# EAGLE design DiveComputer_Flash (EAGLE 7.5.0)
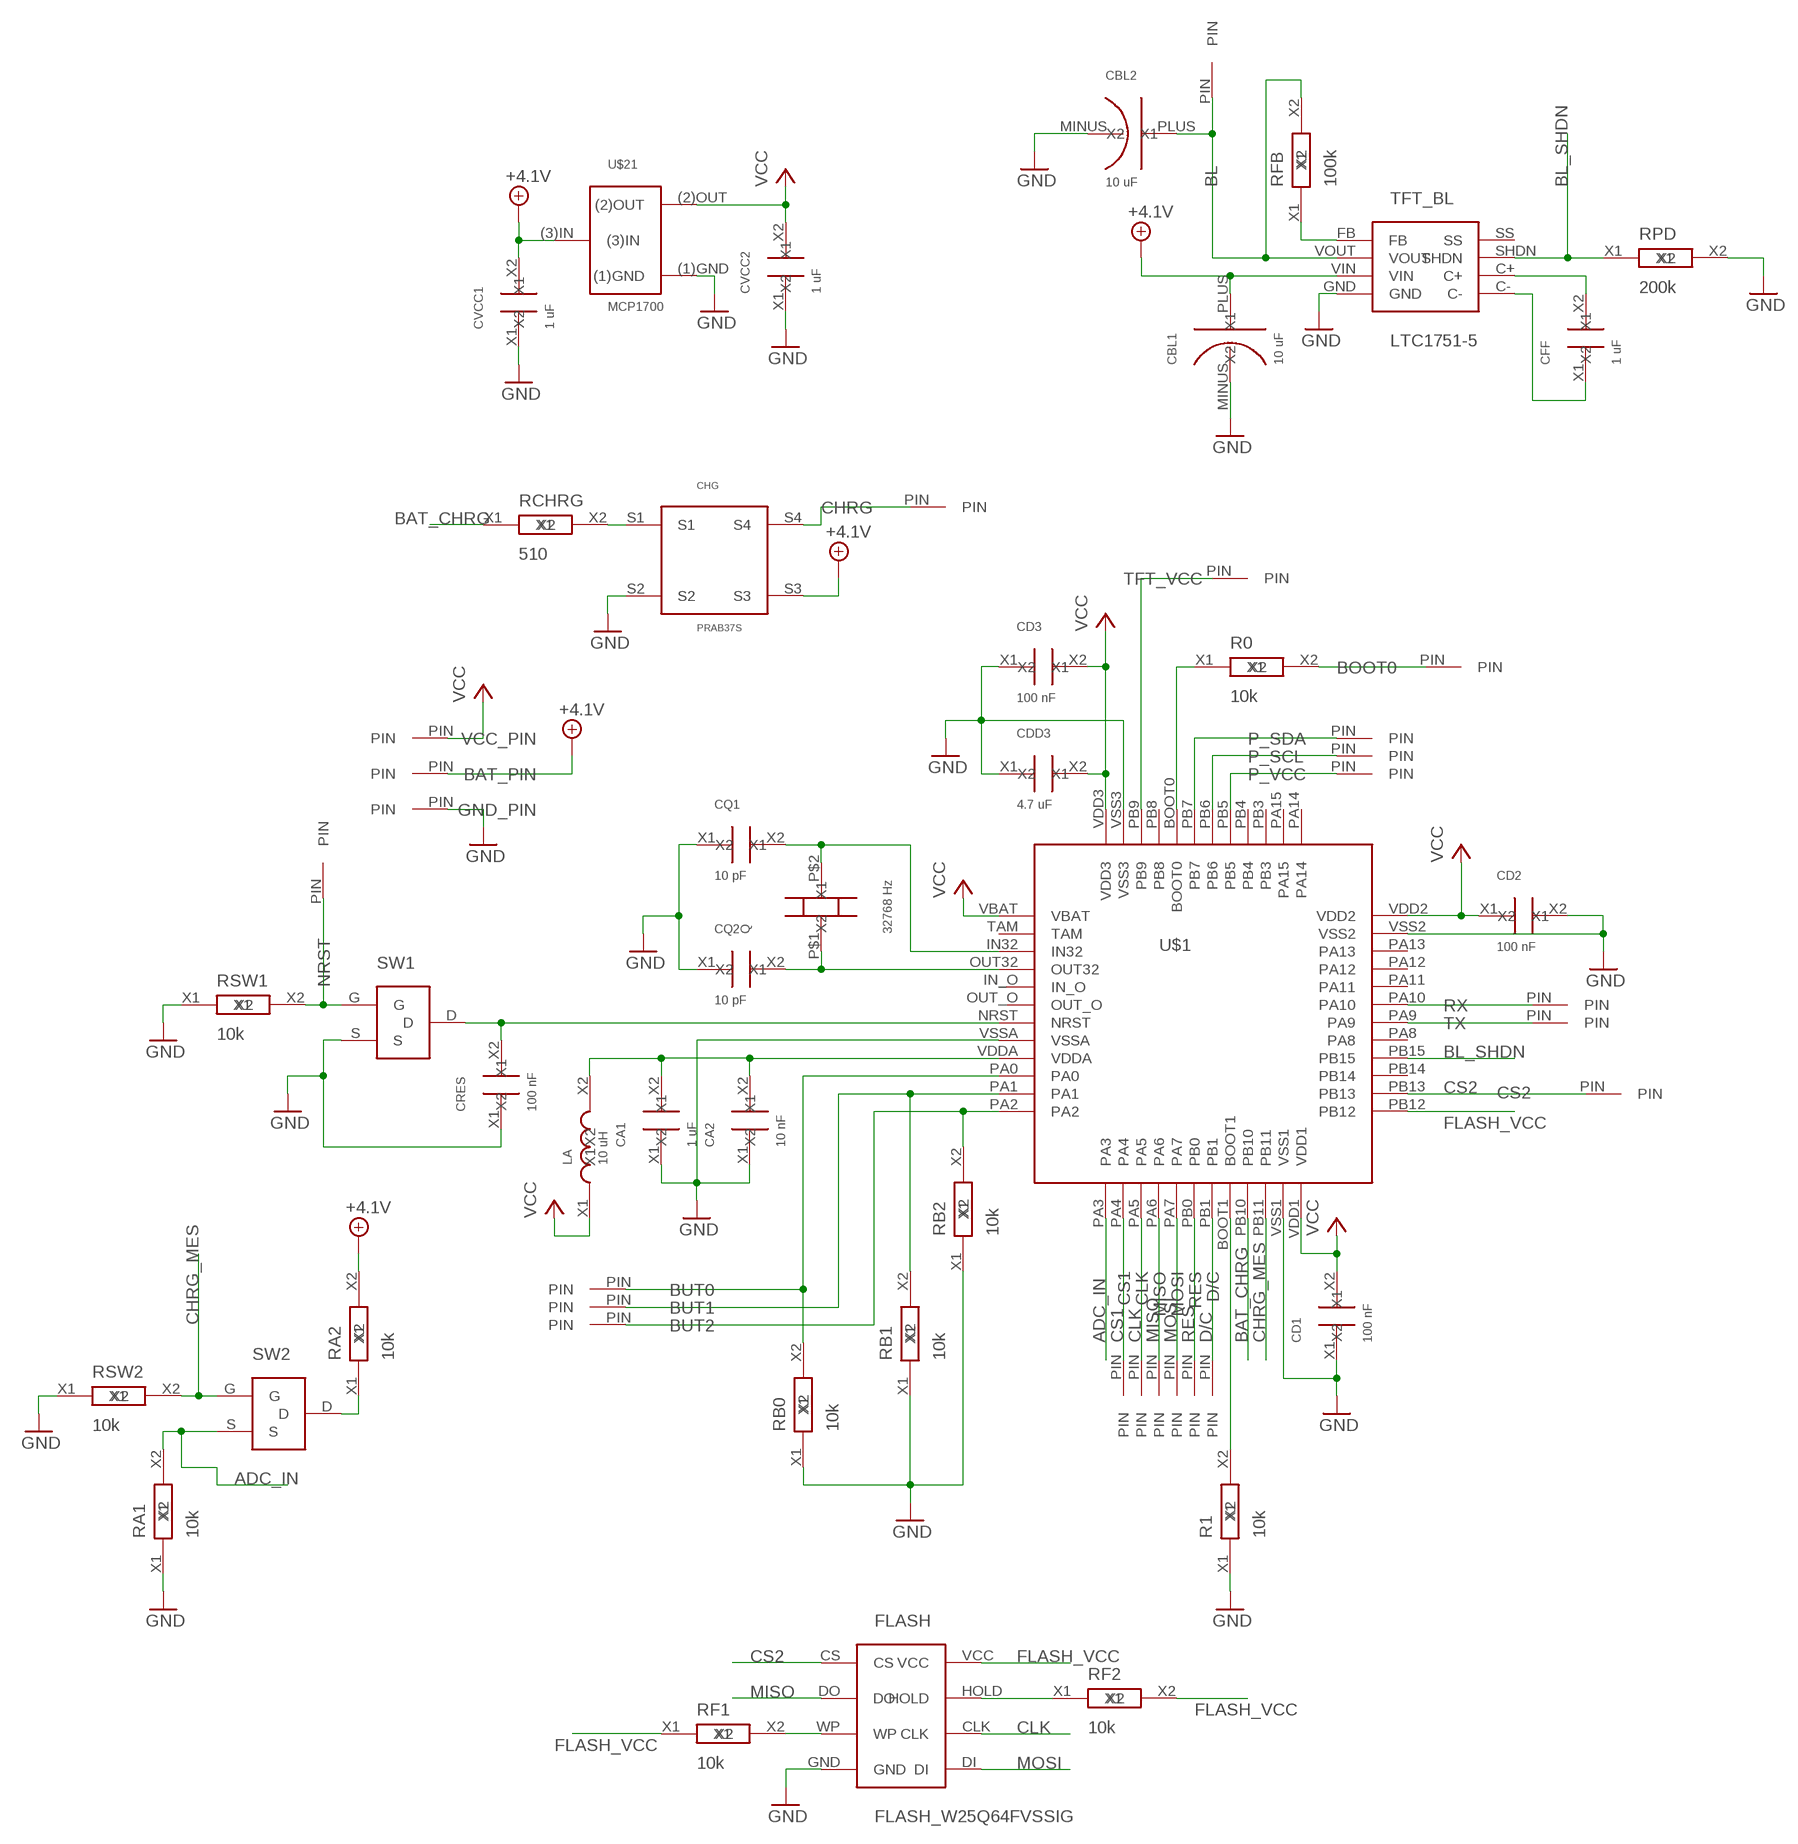
[diagram p0: schematic, sheet 1]

## Parts
BAT_PIN  PIN_06  [PIN_06]
BL  PIN_06  [PIN_06]
BOOT0  PIN_06  [PIN_06]
BUT0  PIN_06  [PIN_06]
BUT1  PIN_06  [PIN_06]
BUT2  PIN_06  [PIN_06]
CA1  1 uF  C_SMD_2.1X1.25  [SMD_2.1X1.25]
CA2  10 nF  C_SMD_2.1X1.25  [SMD_2.1X1.25]
CBL1  10 uF  C_SMD_TA_A  [C_SMD_TA_A]
CBL2  10 uF  C_SMD_TA_A  [C_SMD_TA_A]
CD1  100 nF  C_SMD_2.1X1.25  [SMD_2.1X1.25]
CD2  100 nF  C_SMD_2.1X1.25  [SMD_2.1X1.25]
CD3  100 nF  C_SMD_2.1X1.25  [SMD_2.1X1.25]
CDD3  4.7 uF  C_SMD_2.1X1.25  [SMD_2.1X1.25]
CFF  1 uF  C_SMD_2.1X1.25  [SMD_2.1X1.25]
CHG  PRAB37S  [PRAB37S]
CHRG  PIN_06  [PIN_06]
CLK  PIN_06  [PIN_06]
CQ1  10 pF  C_SMD_2.1X1.25  [SMD_2.1X1.25]
CQ2  10 pF  C_SMD_2.1X1.25  [SMD_2.1X1.25]
CRES  100 nF  C_SMD_2.1X1.25  [SMD_2.1X1.25]
CS1  PIN_06  [PIN_06]
CS2  PIN_06  [PIN_06]
CVCC1  1 uF  C_SMD_2.1X1.25  [SMD_2.1X1.25]
CVCC2  1 uF  C_SMD_2.1X1.25  [SMD_2.1X1.25]
D/C  PIN_06  [PIN_06]
FLASH  FLASH_W25Q64FVSSIG  [FLASH_W25Q64FVSSIG]
GND_PIN  PIN_06  [PIN_06]
LA  10 uH  L_SMD_2.1X1.25  [SMD_2.1X1.25]
MISO  PIN_06  [PIN_06]
MOSI  PIN_06  [PIN_06]
NRST  PIN_06  [PIN_06]
P_SCL  PIN_06  [PIN_06]
P_SDA  PIN_06  [PIN_06]
P_VCC  PIN_06  [PIN_06]
Q  32768 Hz  QUARTZ_CYL  [QUARTZ_CYL]
R0  10k  R_SMD_2.1X1.25  [SMD_2.1X1.25]
R1  10k  R_SMD_2.1X1.25  [SMD_2.1X1.25]
RA1  10k  R_SMD_2.1X1.25  [SMD_2.1X1.25]
RA2  10k  R_SMD_2.1X1.25  [SMD_2.1X1.25]
RB0  10k  R_SMD_2.1X1.25  [SMD_2.1X1.25]
RB1  10k  R_SMD_2.1X1.25  [SMD_2.1X1.25]
RB2  10k  R_SMD_2.1X1.25  [SMD_2.1X1.25]
RCHRG  510  R_SMD_2.1X1.25  [SMD_2.1X1.25]
RES  PIN_06  [PIN_06]
RF1  10k  R_SMD_2.1X1.25  [SMD_2.1X1.25]
RF2  10k  R_SMD_2.1X1.25  [SMD_2.1X1.25]
RFB  100k  R_SMD_2.1X1.25  [SMD_2.1X1.25]
RPD  200k  R_SMD_2.1X1.25  [SMD_2.1X1.25]
RSW1  10k  R_SMD_2.1X1.25  [SMD_2.1X1.25]
RSW2  10k  R_SMD_2.1X1.25  [SMD_2.1X1.25]
RX  PIN_06  [PIN_06]
SW1  IRFML8244TRPBF  [IRFML8244TRPBF]
SW2  IRFML8244TRPBF  [IRFML8244TRPBF]
TFT_BL  LTC1751-5  [LTC1751-5]
TFT_VCC  PIN_06  [PIN_06]
TX  PIN_06  [PIN_06]
U$1  STM32F103CBT6  [STM32F103CBT6]
U$21  MCP1700  [MCP1700]
VCC_PIN  PIN_06  [PIN_06]

## Nets
+4.1V: BAT_PIN.PIN CBL1.PLUS(X2) CHG.S3 CVCC1.X2 RA2.X2 TFT_BL.VIN U$21.(3)IN
ADC_IN: RA1.X2 SW2.S U$1.PA3
BAT_CHRG: RCHRG.X1 U$1.PB10
BL_SHDN: RPD.X1 TFT_BL.SHDN U$1.PB15
CHRG_MES: RSW2.X2 SW2.G U$1.PB11
CLK: CLK.PIN FLASH.CLK U$1.PA5
CS1: CS1.PIN U$1.PA4
CS2: CS2.PIN FLASH.CS U$1.PB13
D/C: D/C.PIN U$1.PB1
FLASH_VCC: FLASH.VCC RF1.X1 RF2.X2 U$1.PB12
GND: CA1.X1 CA2.X1 CBL1.MINUS(X1) CBL2.MINUS(X1) CD1.X1 CD2.X2 CD3.X1 CDD3.X1 CHG.S2 CQ1.X1 CQ2.X1 CRES.X1 CVCC1.X1 CVCC2.X1 FLASH.GND GND_PIN.PIN R1.X1 RA1.X1 RB0.X1 RB1.X1 RB2.X1 RPD.X2 RSW1.X1 RSW2.X1 SW1.S TFT_BL.GND U$1.VSS1 U$1.VSS2 U$1.VSS3 U$1.VSSA U$21.(1)GND
MISO: FLASH.DO MISO.PIN U$1.PA6
MOSI: FLASH.DI MOSI.PIN U$1.PA7
N$1: R0.X1 U$1.BOOT0
N$2: BOOT0.PIN R0.X2
N$3: P_VCC.PIN U$1.PB5
N$4: P_SCL.PIN U$1.PB6
N$5: P_SDA.PIN U$1.PB7
N$6: RX.PIN U$1.PA10
N$7: TX.PIN U$1.PA9
N$8: CQ1.X2 Q.P$2(X2) U$1.IN32
N$9: R1.X2 U$1.BOOT1
N$10: CQ2.X2 Q.P$1(X1) U$1.OUT32
N$11: CRES.X2 SW1.D U$1.NRST
N$12: NRST.PIN RSW1.X2 SW1.G
N$13: CA1.X2 CA2.X2 LA.X2 U$1.VDDA
N$14: BUT0.PIN RB0.X2 U$1.PA0
N$15: BUT1.PIN RB1.X2 U$1.PA1
N$16: BUT2.PIN RB2.X2 U$1.PA2
N$17: CHG.S4 CHRG.PIN
N$18: CHG.S1 RCHRG.X2
N$19: FLASH.WP RF1.X2
N$20: FLASH.HOLD RF2.X1
N$21: RA2.X1 SW2.D
N$22: CFF.X2 TFT_BL.C+
N$23: CFF.X1 TFT_BL.C-
N$24: RFB.X1 TFT_BL.FB
N$25: BL.PIN CBL2.PLUS(X2) RFB.X2 TFT_BL.VOUT
N$26: TFT_VCC.PIN U$1.PB9
RES: RES.PIN U$1.PB0
VCC: CD1.X2 CD2.X1 CD3.X2 CDD3.X2 CVCC2.X2 LA.X1 U$1.VBAT U$1.VDD1 U$1.VDD2 U$1.VDD3 U$21.(2)OUT VCC_PIN.PIN
Unconnected: TFT_BL.SS U$1.IN_O U$1.OUT_O U$1.PA8 U$1.PA11 U$1.PA12 U$1.PA13 U$1.PA14 U$1.PA15 U$1.PB3 U$1.PB4 U$1.PB8 U$1.PB14 U$1.TAM

## Library data of the parts
BAT_PIN BL BOOT0 BUT0 BUT1 BUT2 CHRG CLK CS1 CS2 D/C GND_PIN MISO MOSI NRST P_SCL P_SDA P_VCC RES RX TFT_VCC TX VCC_PIN = My_STM32:PIN_06
CA1 CA2 CD1-CD3 CDD3 CFF CQ1 CQ2 CRES CVCC1 CVCC2 = MyPowerComponents:C_SMD_2.1X1.25
CBL1 CBL2 = MyAmSys:C_SMD_TA_A
CHG = My_STM32:PRAB37S
FLASH = My_STM32:FLASH_W25Q64FVSSIG
LA = MyPowerComponents:L_SMD_2.1X1.25
Q = MySTM32F103RGT6:QUARTZ_CYL
R0 R1 RA1 RA2 RB0 RB1 RB2 RCHRG RF1 RF2 RFB RPD RSW1 RSW2 = MyPowerComponents:R_SMD_2.1X1.25
SW1 SW2 = My_STM32:IRFML8244TRPBF
TFT_BL = MyPowerComponents:LTC1751-5
U$1 = My_STM32:STM32F103CBT6
U$21 = MyCMOSsensor:MCP1700

## Board
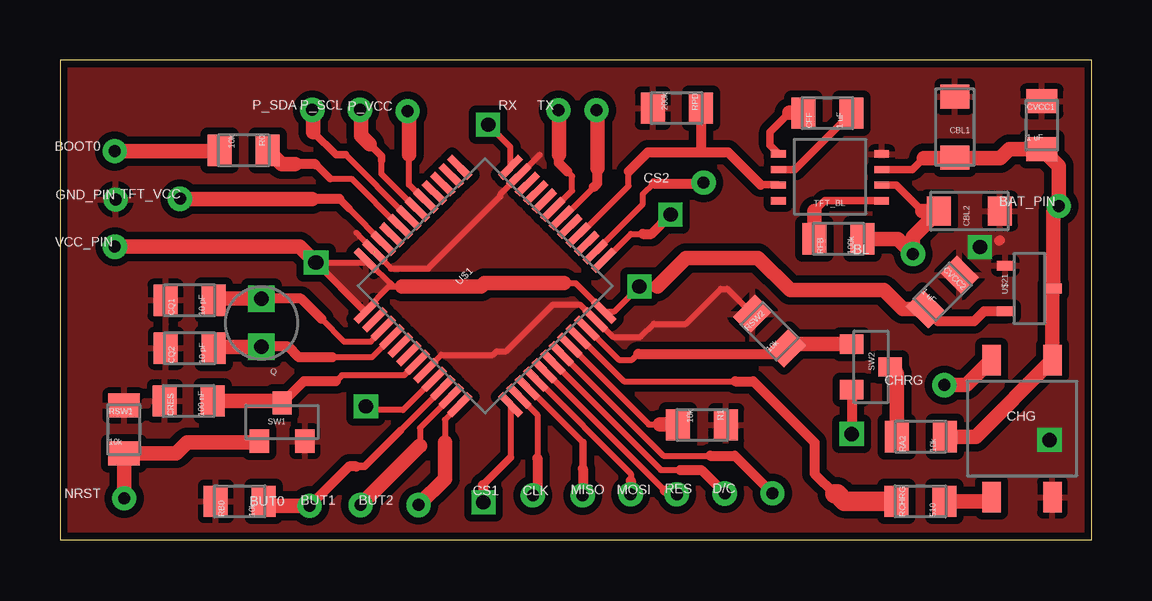
[diagram p1: board, top side]
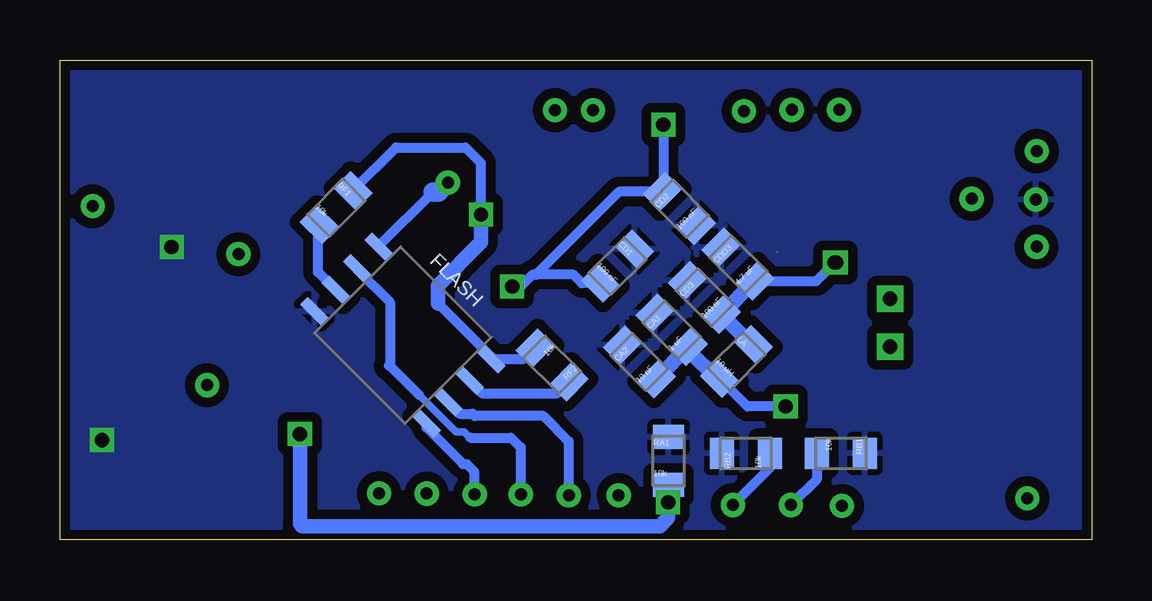
[diagram p2: board, bottom side, seen from below]

Size 43 x 20 mm. Coordinates in mm from the lower left corner, seen from the top.
Outline: 0,0 43,0 43,20 0,20 0,0
Copper layers (1*16): Top 0.035mm / dielectric 1.5mm / Bottom 0.035mm
Design rules "default *": minimum track width 10mil, minimum drill 24mil, track to track 8mil, track to pad 8mil, pad to pad 8mil, via to via 8mil, smd to smd 8mil, copper to edge 10mil, drill to drill 8mil, minimum pad ring 10mil, minimum via ring 8mil, stop-mask expansion 4mil, vias tented up to drill 0mil, thermal gap 10mil

### Footprints (pad centres in the part's own frame; a part is rotated, then mirrored left to right if it is on the bottom)
PIN_06 = drill 0.5: PIN 0,0
SMD_2.1X1.25 = smd 1.3 x 1: X1 0,1; X2 0,-1
C_SMD_TA_A = smd 1.2 x 1: MINUS 0,-1.27; PLUS 0,1.27
PRAB37S = smd 0.762 x 1.27: S1 -1.27,-2.54; S2 1.27,-2.54; S3 1.27,3.175; S4 -1.27,3.175
FLASH_W25Q64FVSSIG = smd 1.27 x 0.432: CLK 2.794,-1.27; CS -3.81,1.27; DI 2.794,-2.54; DO -3.81,0; GND -3.81,-2.54; HOLD 2.794,0; VCC 2.794,1.27; WP -3.81,-1.27
QUARTZ_CYL = drill 0.6 square: P$1 0,1; P$2 0,-1
IRFML8244TRPBF = smd 0.802 x 0.972: D 0,0.8; G -0.95,-0.8; S 0.95,-0.8
LTC1751-5 = smd 0.61 x 0.305: C+ 2.15,0; C- 2.15,-0.65; FB -2.15,1.3; GND -2.15,-0.65; SHDN 2.15,0.65; SS 2.15,1.3; VIN -2.15,0; VOUT -2.15,0.65
STM32F103CBT6 = smd 0.3 x 1.2: BOOT0 -0.75,4.25; BOOT1 0.75,-4.25; PA3 -2.75,-4.25; PA4 -2.25,-4.25; PA5 -1.75,-4.25; PA6 -1.25,-4.25; PA7 -0.75,-4.25; PA14 2.75,4.25; PA15 2.25,4.25; PB0 -0.25,-4.25; PB1 0.25,-4.25; PB3 1.75,4.25; PB4 1.25,4.25; PB5 0.75,4.25; PB6 0.25,4.25; PB7 -0.25,4.25; PB8 -1.25,4.25; PB9 -1.75,4.25; PB10 1.25,-4.25; PB11 1.75,-4.25; VDD1 2.75,-4.25; VDD3 -2.75,4.25; VSS1 2.25,-4.25; VSS3 -2.25,4.25 | smd 1.2 x 0.3: IN32 -4.25,1.75; IN_O -4.25,0.75; NRST -4.25,-0.25; OUT32 -4.25,1.25; OUT_O -4.25,0.25; PA0 -4.25,-1.75; PA1 -4.25,-2.25; PA2 -4.25,-2.75; PA8 4.25,-0.75; PA9 4.25,-0.25; PA10 4.25,0.25; PA11 4.25,0.75; PA12 4.25,1.25; PA13 4.25,1.75; PB12 4.25,-2.75; PB13 4.25,-2.25; PB14 4.25,-1.75; PB15 4.25,-1.25; TAM -4.25,2.25; VBAT -4.25,2.75; VDD2 4.25,2.75; VDDA -4.25,-1.25; VSS2 4.25,2.25; VSSA -4.25,-0.75
MCP1700 = smd 0.4 x 0.7: (1)GND -0.95,-2; (2)OUT 0.95,-2; (3)IN 0,0

### Placement (x,y rotation side)
BAT_PIN  41.64,13.9 0 top
BL  35.56,11.9 0 top
BOOT0  2.28,16.2 0 top
BUT0  10.4,1.4 0 top
BUT1  12.53,1.44 0 top
BUT2  14.95,1.44 0 top
CA1  17.5,8.75 45 bottom
CA2  18.85,7.4 45 bottom
CBL1  37.3,17.2 180 top
CBL2  37.91,13.7 90 top
CD1  19.76,11.4 315 bottom
CD2  17.17,13.8 45 bottom
CD3  16.13,10.1 45 bottom
CDD3  14.73,11.48 45 bottom
CFF  31.99,17.78 90 top
CHG  40.1,4.31 0 top
CHRG  36.87,6.44 0 top
CLK  21.79,1.84 0 top
CQ1  5.4,9.98 90 top
CQ2  5.41,7.98 90 top
CRES  5.37,5.78 90 top
CS1  19.71,1.84 0 top
CS2  26.83,14.88 0 top
CVCC1  40.93,17.28 0 top
CVCC2  36.79,10.33 315 top
D/C  29.7,1.93 0 top
FLASH  27.9,8.61 315 bottom
GND_PIN  2.32,14.18 0 top
LA  14.8,7.43 315 bottom
MISO  23.79,1.88 0 top
MOSI  25.71,1.88 0 top
NRST  2.68,1.72 0 top
P_SCL  12.5,17.92 0 top
P_SDA  10.52,17.92 0 top
P_VCC  14.49,17.87 0 top
Q  8.4,9.04 180 top
R0  7.66,16.23 270 top
R1  26.77,4.78 270 top
RA1  17.63,3.28 0 bottom
RA2  35.88,4.29 90 top
RB0  7.49,1.59 90 top
RB1  10.45,3.59 270 bottom
RB2  14.41,3.59 90 bottom
RCHRG  35.87,1.59 90 top
RES  27.71,1.92 0 top
RF1  31.48,13.84 315 bottom
RF2  22.49,7.29 225 bottom
RFB  32.45,12.54 90 top
RPD  25.71,17.99 270 top
RSW1  2.67,4.59 0 top
RSW2  29.58,8.69 45 top
RX  20.78,17.91 0 top
SW1  9.26,4.9 0 top
SW2  33.8,7.2 270 top
TFT_BL  32.1,15.43 180 top
TFT_VCC  5,14.21 0 top
TX  22.37,17.91 0 top
U$1  17.72,10.58 45 top
U$21  41.41,10.47 270 top
VCC_PIN  2.29,12.21 0 top

### Tracks (layer width: path | path; a pad name or v marks a point on that pad's centre or on a via)
+4.1V
  Top 0.305: TFT_BL.VIN 35.53,15.43 36,15.9
  Top 0.61: 36,15.9 37.27,15.9 CBL1.PLUS 37.33,15.9 39.2,15.9 39.58,16.28 CVCC1.X2 41.64,15.57 BAT_PIN.PIN 41.41,13.67 U$21.(3)IN 41.37,10.43 CHG.S3 38.17,4.29 RA2.X2
ADC_IN  (via drill 0.6)
  Top 0.254: U$1.PA3 18.78,3.43 | 17.63,1.77 17.65,1.75 v17.65,1.55
  Top 0.305: 18.78,3.43 RA1.X2
  Top 0.406: SW2.S v33,4.4 | RA1.X2 17.63,1.57 v17.65,1.55 17.65,2.26 RA1.X2
  Bottom 0.61: v33,4.4 33,0.65 32.9,0.55 18,0.55 17.65,0.9 v17.65,1.55 17.65,2.26 RA1.X2
BAT_CHRG
  Top 0.254: U$1.PB10 21.64,8.46 23.5,6.6 28.15,6.6
  Top 0.406: 32.3,1.9 31.45,2.75 31.45,4.05 28.9,6.6 28.15,6.6
  Top 0.813: 32.3,1.9 32.4,1.9 32.7,1.6 RCHRG.X1
BL_SHDN
  Top 0.254: U$1.PB15 21.65,12.7 23.7,14.75 23.7,15.35
  Top 0.305: 29.2,14.8 29.93,14.8 TFT_BL.SHDN
  Top 0.406: 23.7,15.35 24.5,16.15 26.75,16.15 | 26.75,16.15 27.85,16.15 29.2,14.8 | RPD.X1 26.71,16.19 26.75,16.15
CHRG_MES
  Top 0.254: U$1.PB11 21.99,8.81 23.3,7.5 23.85,7.5 24.1,7.75
  Top 0.406: 24.1,7.75 30.05,7.75 RSW2.X2
  Top 0.61: RSW2.X2 30.58,7.98 30.75,8.15 SW2.G
CLK
  Top 0.254: U$1.PA5 19.51,6.34 21.8,4.05
  Top 0.305: 21.8,4.05 21.8,2.95
  Top 0.406: 21.8,2.95 CLK.PIN
  Bottom 0.406: FLASH.CLK 26.82,5.72 26.35,5.25 25.8,5.25 25.7,5.15 22.85,5.15 21.8,4.1 CLK.PIN
CS1
  Top 0.254: U$1.PA4 19.13,5.97 19.9,5.2 19.9,3.4
  Top 0.406: 19.9,3.4 19.9,2.03 CS1.PIN
CS2
  Top 0.254: U$1.PB13 22.32,12.02 24.3,14 24.3,14.4 24.75,14.85
  Top 0.406: 24.75,14.85 26.8,14.85 CS2.PIN
  Bottom 0.406: 26.85,14.86 CS2.PIN | FLASH.CS 29.7,12.25 27.45,14.5
  Bottom 0.813: 27.45,14.5 27.21,14.5 CS2.PIN
D/C
  Top 0.254: U$1.PB1 25.15,3.5 27.1,3.5
  Top 0.406: 27.1,3.5 28.13,3.5 D/C.PIN
FLASH_VCC  (via drill 0.6)
  Top 0.254: U$1.PB12 22.69,11.64 23.8,12.75 24.3,12.75
  Top 0.406: 24.3,12.75 24.65,12.75 v25.45,13.55
  Bottom 0.406: 25.6,13.4 v25.45,13.55 25.45,15.7 26.1,16.35 29,16.35 30.77,14.58 RF1.X1 | 23.48,7.53 RF2.X2 23.66,7.53 FLASH.VCC 24.84,7.35 24.75,7.35 27.25,9.85
  Bottom 0.61: 27.25,9.85 27.25,10.6 25.45,12.4 v25.45,13.55
GND  (via drill 0.6)  (1 unrouted)
  Top 0.254: RSW2.X1 27.82,10.45 27.55,10.45 26.1,9 24.75,9 24.2,8.45 23.05,8.45 22.33,9.17 U$1.VSS1 21.68,9.8 20.55,9.8 18.6,7.85 18.2,7.85 18.05,7.7 15.9,7.7 U$1.VSSA | U$1.VSS3 13.12,11.98 13.8,11.3 15.35,11.3 18.35,14.3 18.35,14.39 U$1.VSS2 | 13.1,12 12.35,12.8 | 19.05,15.1 20,16.05
  Top 0.406: 39.18,12.48 39.15,12.45 | 38.6,12.45 v38.35,12.2 | 41.37,4.03 v41.25,4.15
  Bottom 0.406: v38.35,12.2 38.35,12.5
  pour Bottom (isolate 0.406): 0,0 0,20 43,20 43,0
  pour Top (isolate 0.305): 0,20 43,20 43,0 0,0
MISO
  Top 0.254: U$1.PA6 19.86,6.69 23.8,2.75 23.8,2.45
  Top 0.406: 23.8,2.45 MISO.PIN
  Bottom 0.305: 28.05,6.05 26.5,4.5 26.15,4.5 25.9,4.25
  Bottom 0.406: FLASH.DO 30.59,11.24 29.25,9.9 29.25,7.3 29.3,7.25 29.25,7.25 28.05,6.05 | MISO.PIN 23.8,3.85 24.2,4.25 25.9,4.25
MOSI
  Top 0.254: U$1.PA7 20.21,7.04 25.2,2.05
  Top 0.406: 25.2,2.05 25.54,2.05 MOSI.PIN
  Bottom 0.406: 25.67,1.92 MOSI.PIN 25.75,1.92 25.75,2.85 26.05,3.15 26.2,3.15 27.72,4.67 FLASH.DI
N$1
  Top 0.254: U$1.BOOT0 14.14,13.05 12.15,15.05 11.25,15.05
  Top 0.305: 11.25,15.05 10.65,15.65
  Top 0.406: 10.65,15.65 9.8,15.65
  Top 0.61: 9.8,15.65 9.24,15.65 R0.X1
N$2
  Top 0.61: BOOT0.PIN 6.63,16.2 R0.X2
N$3
  Top 0.254: U$1.PB5 15.23,14.12 14.55,14.8 14.55,16.05
  Top 0.61: 14.55,16.05 14.55,17.81 P_VCC.PIN
N$4
  Top 0.254: U$1.PB6 13.4,15.25 13.4,15.8
  Top 0.305: 13.4,15.8 13.4,16 12.9,16.5
  Top 0.61: 12.9,16.5 12.55,16.85 12.55,17.87 P_SCL.PIN
N$5
  Top 0.254: U$1.PB7 11.9,16.05
  Top 0.305: 11.9,16.05 11.5,16.05 10.55,17
  Top 0.61: 10.55,17 10.55,17.89 P_SDA.PIN
N$6
  Top 0.254: U$1.PA10 20.56,13.76 21.35,14.55 21.35,15.15 21.15,15.35
  Top 0.406: 21.15,15.35 20.8,15.7 20.8,16.05
  Top 0.61: 20.8,16.05 20.8,17.89 RX.PIN
N$7
  Top 0.254: U$1.PA9 20.96,13.41 22.25,14.7
  Top 0.406: 22.25,14.7 22.4,14.85 22.4,15.5
  Top 0.61: 22.4,15.5 22.4,17.88 TX.PIN
N$8
  Top 0.254: U$1.IN32 13.48,8.78 12.95,8.25 11.85,8.25 10.9,9.2
  Top 0.406: 10.9,9.2 10.05,10.05 Q.P$2
  Top 0.61: Q.P$2 6.47,10.05 CQ1.X2
N$9
  Top 0.254: U$1.BOOT1 21.26,8.09 24.55,4.8 25,4.8
  Top 0.61: 25,4.8 25.75,4.8 R1.X2
N$10
  Top 0.254: U$1.OUT32 13.83,8.43 13,7.6 11.35,7.6
  Top 0.406: 11.35,7.6 9.95,7.6 9.5,8.05 Q.P$1
  Top 0.61: Q.P$1 6.47,8.04 CQ2.X2
N$11
  Top 0.254: U$1.NRST 14.35,6.85 11.75,6.85 11.5,6.6
  Top 0.406: 11.5,6.6 10.16,6.6 SW1.D
  Top 0.61: CRES.X2 9.18,5.78 SW1.D
N$12
  Top 0.61: NRST.PIN RSW1.X2 4.84,3.59 5.3,4.05 8.26,4.05 SW1.G
N$13  (via drill 0.6)
  Top 0.254: U$1.VDDA 14.3,5.4 12.9,5.4 v12.75,5.55
  Bottom 0.254: U$1.VDDA 15.47,6.69 15.12,6.33
  Bottom 0.406: v12.75,5.55 14.33,5.55 15.12,6.33 LA.X2
  Bottom 0.61: CA2.X2 CA1.X2 16.79,7.88 U$1.VDDA
N$14
  Top 0.254: U$1.PA0 15.95,6.3 14.2,4.55
  Top 0.305: 14.2,4.55 12.7,3.05 12.35,3.05
  Top 0.406: 12.35,3.05 12.05,3.05 BUT0.PIN
  Top 0.61: BUT0.PIN 8.68,1.4 RB0.X2
N$15
  Top 0.254: U$1.PA1 16.31,5.96 15,4.65 15,3.9
  Top 0.61: 15,3.9 14.99,3.9 BUT1.PIN
  Bottom 0.406: RB1.X2 11.45,2.52 BUT1.PIN
N$16
  Top 0.254: U$1.PA2 16.66,5.61 16.05,5 16.05,4.05
  Top 0.61: 16.05,4.05 16.05,2.54 BUT2.PIN
  Bottom 0.406: RB2.X2 13.41,2.98 BUT2.PIN
N$17
  Top 0.61: CHRG.PIN 37.78,6.44 CHG.S4
N$18
  Top 0.61: RCHRG.X2 38.65,1.59 CHG.S1
N$19
  Bottom 0.406: FLASH.WP 31.51,10.41 32.25,11.15 32.25,13.07 RF1.X2
N$20
  Bottom 0.406: FLASH.HOLD 25.88,6.63 25.55,6.3 25.55,6.25 25.4,6.1 22.27,6.1 RF2.X1
N$21
  Top 0.61: RA2.X1 34.88,6.92 SW2.D
N$22
  Top 0.305: TFT_BL.C+ 30.64,15.43 CFF.X2
N$23
  Top 0.305: TFT_BL.C- 29.95,16.1 29.6,16.45 29.6,17 30.4,17.8
  Top 0.61: 30.4,17.8 30.97,17.8 CFF.X1
N$24
  Top 0.305: TFT_BL.FB 31.88,14.13 31.45,13.7
  Top 0.61: 31.45,13.7 RFB.X1
N$25
  Top 0.305: TFT_BL.VOUT 34.87,14.78 35.95,13.7
  Top 0.61: 35.95,13.7 CBL2.PLUS 35.56,12.62 BL.PIN 34.92,12.54 RFB.X2
N$26
  Top 0.254: U$1.PB9 13.48,12.37 12.05,13.8
  Top 0.305: 11.65,14.2 12.05,13.8
  Top 0.406: 11.65,14.2 10.5,14.2
  Top 0.61: 10.5,14.2 TFT_VCC.PIN
RES
  Top 0.254: U$1.PB0 25.05,2.9 25.85,2.9
  Top 0.406: 25.85,2.9 26.73,2.9 RES.PIN
VCC  (via drill 0.6)
  Top 0.254: v24.15,10.55 23.12,9.52 U$1.VDD1 21.5,10.69 21,10.69 | U$1.VDD2 18.78,16.37 v17.85,17.3 | U$1.VDD3 12.68,11.55 v10.7,11.55 12.75,9.5 12.75,9.6 13.7,10.55 13.9,10.55 | U$1.VBAT 12.68,9.52 v10.65,11.55 | 13.9,10.55 14.25,10.55 | 12.8,11.6 13.9,10.55
  Top 0.406: U$21.(2)OUT 38.52,9.52 38.1,9.1 36.61,9.1 CVCC2.X2 | v24.15,10.55 24.9,10.55 | v10.7,11.55 v10.65,11.55
  Top 0.61: CVCC2.X2 35.13,9.62 34.35,10.4 30.45,10.4 29.1,11.75 26.1,11.75 24.9,10.55 | VCC_PIN.PIN 9.99,12.21 v10.65,11.55 | 14.25,10.55 17.55,10.55 17.7,10.7 20.99,10.7 21,10.69
  Bottom 0.254: CD3.X2 15.42,9.43 14.05,10.8 11.4,10.8 v10.65,11.55
  Bottom 0.406: v24.15,10.55 23.8,10.55 23.3,11.05 23.15,11.05 | CD1.X2 21.24,10.69 21.6,11.05 23.15,11.05 | 23.15,11.05 19.69,14.51 CD2.X1 17.85,14.53 v17.85,17.3 | CDD3.X2 11.48,10.77 v10.7,11.55
  Bottom 0.61: LA.X1 14.17,8.14 CD3.X2 14.04,10.77 CDD3.X2
  pour Top (isolate 0.406): 11,11.4 12.75,11.45 13.6,10.65 12.7,9.8